# Altium schematic sheet Main.SchDoc
size A3; CompanyName: Ok's Lab; Engineer: Oktay Topcu; SheetNumber: 1; SheetTotal: 7; UniqueID: 20200803; X2: A3; X3: 20200803; X4: r1.0; X6: 1; X7: 7; X8: Main.SchDoc
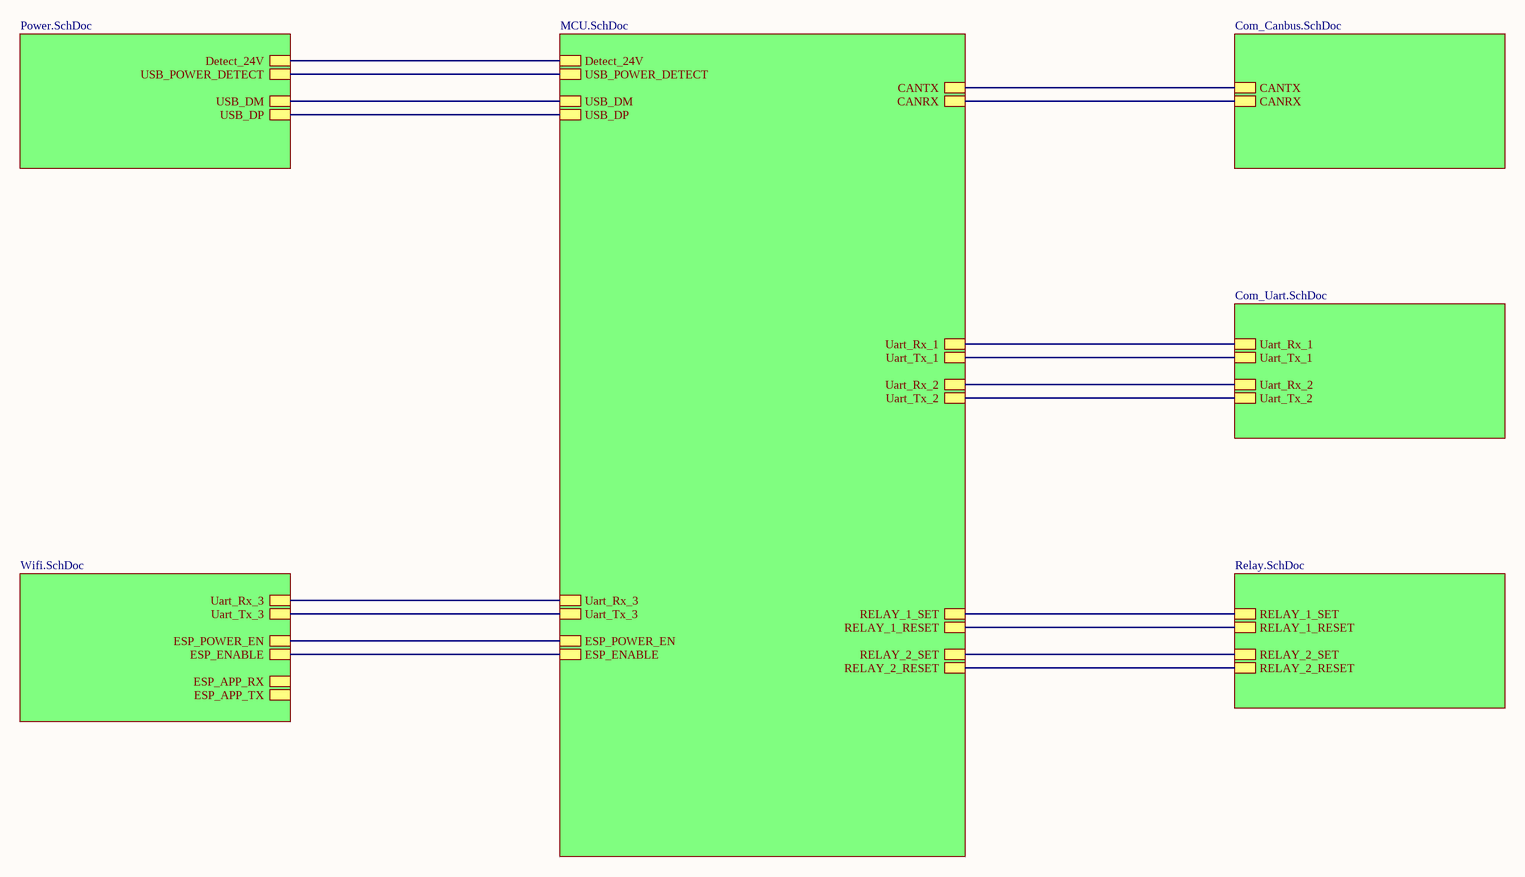
[diagram p0: Main.SchDoc]

## Sub-sheets
Canbus = Com_Canbus.SchDoc: CANTX, CANRX
MCU = MCU.SchDoc: RELAY_1_SET, RELAY_2_SET, RELAY_2_RESET, RELAY_1_RESET, Uart_Rx_1, Uart_Tx_1, Uart_Rx_2, Uart_Tx_2, Detect_24V, USB_DM, USB_DP, Uart_Rx_3, Uart_Tx_3, ESP_POWER_EN, ESP_ENABLE, CANRX, CANTX, USB_POWER_DETECT
Power = Power.SchDoc: Detect_24V, USB_DM, USB_DP, USB_POWER_DETECT
Relay = Relay.SchDoc: RELAY_1_RESET, RELAY_2_SET, RELAY_1_SET, RELAY_2_RESET
Uart = Com_Uart.SchDoc: Uart_Rx_1, Uart_Tx_1, Uart_Rx_2, Uart_Tx_2
Wifi = Wifi.SchDoc: Uart_Tx_3, Uart_Rx_3, ESP_POWER_EN, ESP_ENABLE, ESP_APP_RX, ESP_APP_TX

## Nets
(unnamed): sheet MCU/RELAY_1_SET, sheet Relay/RELAY_1_SET
(unnamed): sheet MCU/RELAY_2_SET, sheet Relay/RELAY_2_SET
(unnamed): sheet MCU/RELAY_2_RESET, sheet Relay/RELAY_2_RESET
(unnamed): sheet MCU/RELAY_1_RESET, sheet Relay/RELAY_1_RESET
(unnamed): sheet MCU/Uart_Rx_1, sheet Uart/Uart_Rx_1
(unnamed): sheet MCU/Uart_Tx_1, sheet Uart/Uart_Tx_1
(unnamed): sheet MCU/Uart_Rx_2, sheet Uart/Uart_Rx_2
(unnamed): sheet MCU/Uart_Tx_2, sheet Uart/Uart_Tx_2
(unnamed): sheet MCU/Detect_24V, sheet Power/Detect_24V
(unnamed): sheet MCU/USB_DM, sheet Power/USB_DM
(unnamed): sheet MCU/USB_DP, sheet Power/USB_DP
(unnamed): sheet MCU/Uart_Rx_3, sheet Wifi/Uart_Rx_3
(unnamed): sheet MCU/Uart_Tx_3, sheet Wifi/Uart_Tx_3
(unnamed): sheet MCU/ESP_POWER_EN, sheet Wifi/ESP_POWER_EN
(unnamed): sheet MCU/ESP_ENABLE, sheet Wifi/ESP_ENABLE
(unnamed): sheet MCU/CANRX, sheet Canbus/CANRX
(unnamed): sheet MCU/CANTX, sheet Canbus/CANTX
(unnamed): sheet MCU/USB_POWER_DETECT, sheet Power/USB_POWER_DETECT

## Notes on the sheet
- Title
- Size:
- Date:
- Number:
- Revision:
- Sheet
- of
- File: